# Altium schematic sheet High-FrequencyOp-AmpTransimpedanceCircuit.SchDoc
size A4; SheetNumber: 3; SheetTotal: 3
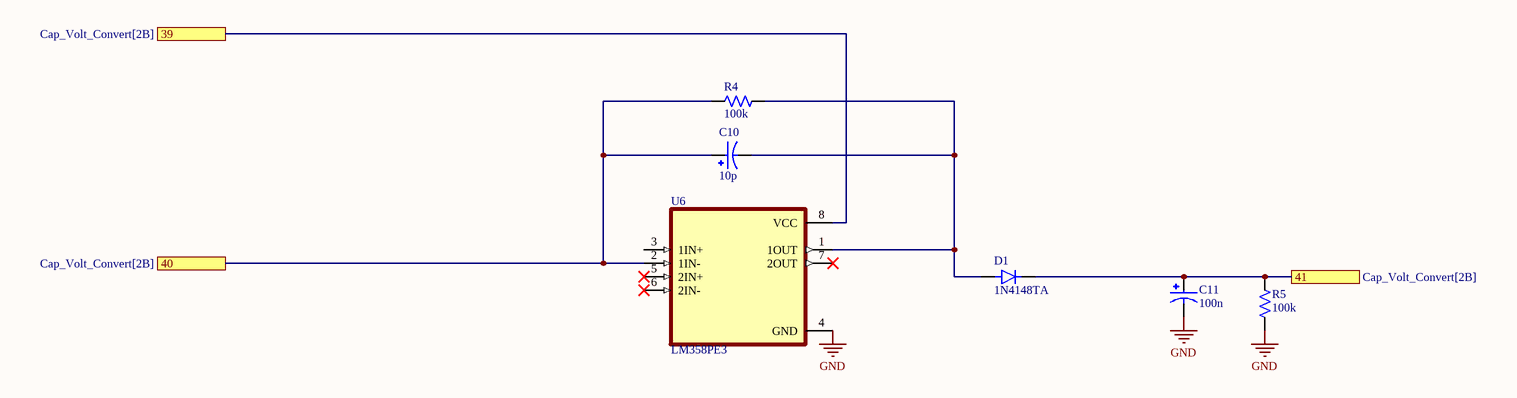
[diagram p0: High-FrequencyOp-AmpTransimpedanceCircuit.SchDoc]

## Parts
C10  10p  [CAPPRD750W80D1600H2000]
C11  100n  [CAPPRD750W80D1600H2000]
D1  1N4148TA  [DIOAD753W49L380D172B]
R4  100k  [RESAD730W45L370D210]
R5  100k  [RESAD730W45L370D210]
U6  LM358PE3  [DIP794W45P254L959H508Q8 - duplicate]

## Ports
39 (see Cap_Volt_Convert[2B]), 40 (see Cap_Volt_Convert[2B]), 41 (see Cap_Volt_Convert[2B])

## Nets
GND: C11.N R5.1 U6.4(GND)
39: U6.8(VCC) ; port 39
40: C10.P R4.1 U6.2(1IN-) ; port 40
41: C11.P D1.K R5.2 ; port 41
NetC10_N: C10.N D1.A R4.2 U6.1(1OUT)

Not connected (* = marked no-connect by the designer): U6 3(1IN+) 5(2IN+)* 6(2IN-)* 7(2OUT)*

## Library data of the parts
C10 C11 = EEUFS1J681S: CAP ALUM 680UF 20% 63V THRU HOLE; MP: EEU-FS1J681S; MF: Panasonic Electronic Components; Package: RADIAL-2 Panasonic; Availability: In Stock; SnapEDA_Link: https://www.snapeda.com/parts/EEU-FS1J681S/Panasonic/view-part/5562022/?ref=snap; Price: None; Check_prices: https://www.snapeda.com/parts/EEU-FS1J681S/Panasonic/view-part/5562022/?ref=eda; Value: *
D1 = 1N4148TA: Diode Standard 100 V 200mA Through Hole DO-35; MF: ON Semiconductor; SnapEDA_Link: https://www.snapeda.com/parts/1N4148TA/Onsemi/view-part/?ref=snap; Package: AXIAL LEAD-2 ON Semiconductor; Value: *; MP: 1N4148TA; Check_prices: https://www.snapeda.com/parts/1N4148TA/Onsemi/view-part/?ref=eda
R4 R5 = MFR-12FTE52-12K5: Metal Film Resistors - Through Hole; MF: YAGEO; SnapEDA_Link: https://www.snapeda.com/parts/MFR-12FTE52-12K5/Yageo/view-part/?ref=snap; Package: RADIAL-2 Yageo; Value: *; MP: MFR-12FTE52-12K5; Check_prices: https://www.snapeda.com/parts/MFR-12FTE52-12K5/Yageo/view-part/?ref=eda
U6 = LM358PE3: Dual, 30-V, 700-kHz operational amplifier; MF: Texas Instruments; SnapEDA_Link: https://www.snapeda.com/parts/LM358PE3/Texas+Instruments/view-part/?ref=snap; Package: PDIP-8 Texas; Value: *; MP: LM358PE3; Check_prices: https://www.snapeda.com/parts/LM358PE3/Texas+Instruments/view-part/?ref=eda